# Altium schematic sheet Peripheral.SchDoc
size A4; SheetNumber: 5; SheetTotal: 5
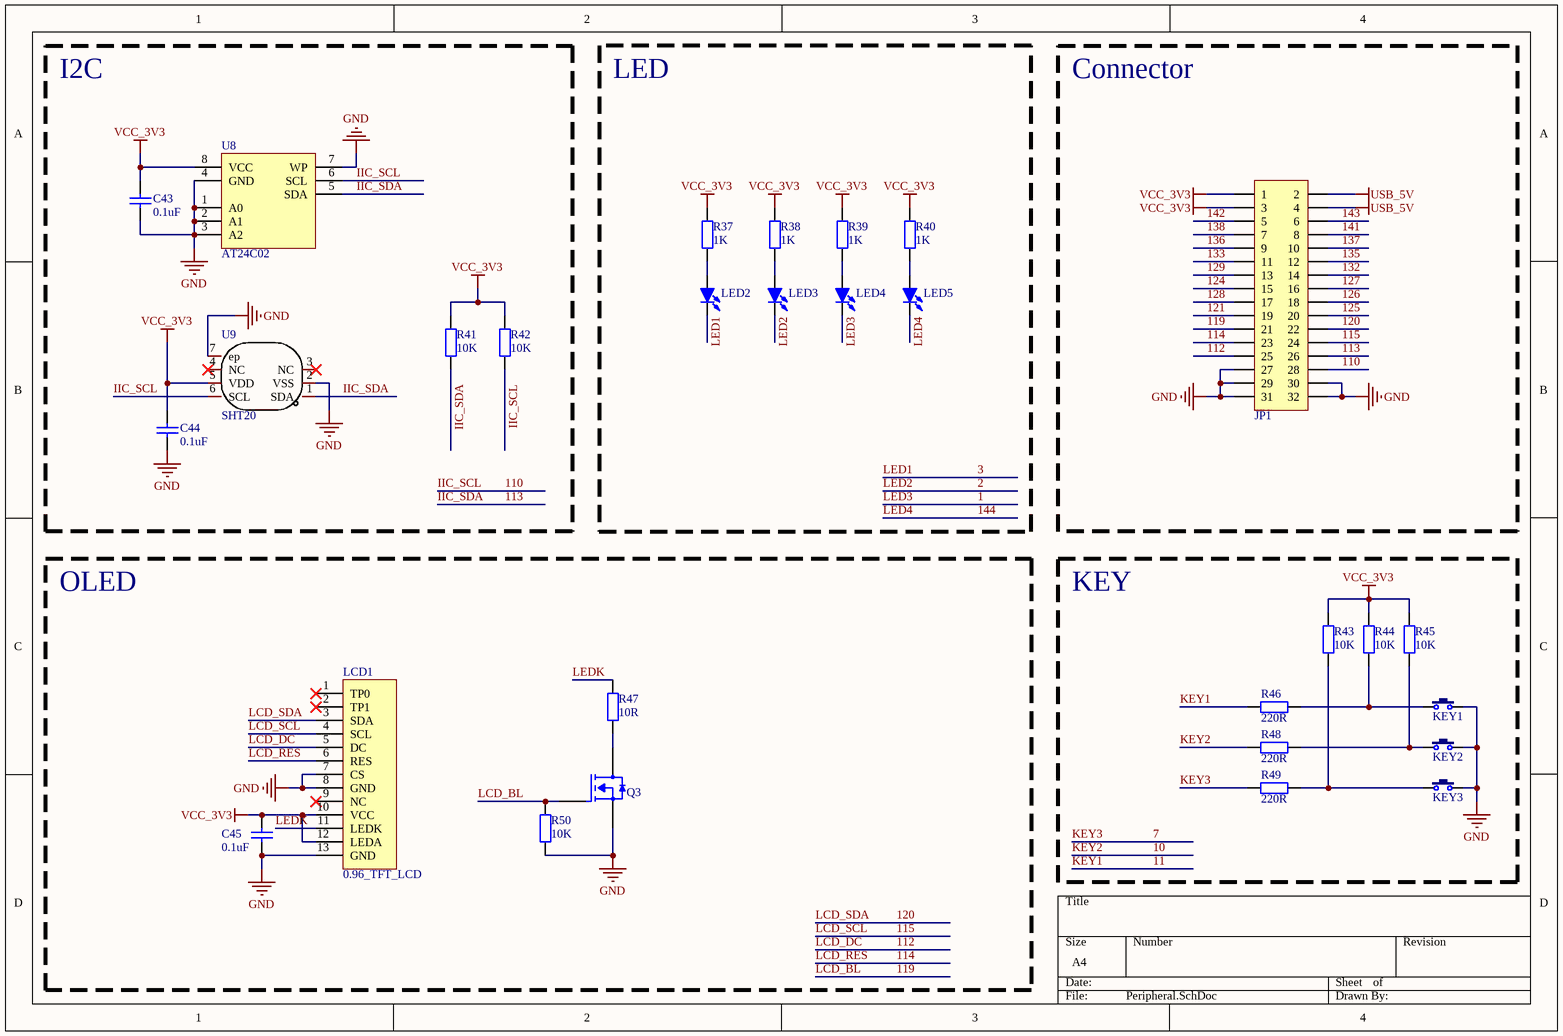
[diagram p0: Peripheral.SchDoc]

## Parts
C43  0.1uF  [0402_C]
C44  0.1uF  [0402_C]
C45  0.1uF  [0402_C]
JP1  Header 2X11  [HDR2.54-LI-2x16P]  (value not drawn)
KEY1  3x6x5  [SW]  (value not drawn)
KEY2  3x6x5  [SW]  (value not drawn)
KEY3  3x6x5  [SW]  (value not drawn)
LCD1  0.96_TFT_LCD  [0.78_TFT_LCD]
LED2  红色  [LED 0603B]  (value not drawn)
LED3  红色  [LED 0603G]  (value not drawn)
LED4  红色  [LED 0603R]  (value not drawn)
LED5  红色  [LED 0603R]  (value not drawn)
Q3  AO3400A  [SOT23-3]  (value not drawn)
R37  1K  [0402_R]
R38  1K  [0402_R]
R39  1K  [0402_R]
R40  1K  [0402_R]
R41  10K  [0402_R]
R42  10K  [0402_R]
R43  10K  [0402_R]
R44  10K  [0402_R]
R45  10K  [0402_R]
R46  220R  [0402_R]
R47  10R  [0402_R]
R48  220R  [0402_R]
R49  220R  [0402_R]
R50  10K  [0402_R]
U8  AT24C02  [SOP8_N]
U9  SHT20  [DFN-6_L3.0-W3.0-P0.95-TR-EP]

## Blocks framed on the sheet
I2C: C43 C44 R41 R42 U8 U9
LED: LED2-LED5 R37-R40
Connector: JP1
OLED: C45 LCD1 Q3 R47 R50
KEY: KEY1-KEY3 R43-R46 R48 R49

## Nets
GND: C43.1 C44.1 C45.1 JP1.27 JP1.29 JP1.30 JP1.31 JP1.32 KEY1.1 KEY2.1 KEY3.1 LCD1.7(CS) LCD1.8(GND) LCD1.13(GND) Q3.2(S) R50.1 U8.1(A0) U8.2(A1) U8.3(A2) U8.4(GND) U8.7(WP) U9.2(VSS) U9.7(ep)
USB_5V: JP1.2 JP1.4
VCC_3V3: C43.2 C44.2 C45.2 JP1.1 JP1.3 LCD1.10(VCC) LCD1.12(LEDA) R37.2 R38.2 R39.2 R40.2 R41.1 R42.1 R43.1 R44.2 R45.2 U8.8(VCC) U9.5(VDD)
1: LED4.2(K)  [also labelled LED3]
2: LED3.2(K)  [also labelled LED2]
3: LED2.2(K)  [also labelled LED1]
7: R49.2  [also labelled KEY3]
10: R48.2  [also labelled KEY2]
11: R46.2  [also labelled KEY1]
110: JP1.28 R42.2 U8.6(SCL) U9.6(SCL)  [also labelled IIC_SCL]
112: JP1.25 LCD1.5(DC)  [also labelled LCD_DC]
113: JP1.26 R41.2 U8.5(SDA) U9.1(SDA)  [also labelled IIC_SDA]
114: JP1.23 LCD1.6(RES)  [also labelled LCD_RES]
115: JP1.24 LCD1.4(SCL)  [also labelled LCD_SCL]
119: JP1.21 Q3.1(G) R50.2  [also labelled LCD_BL]
120: JP1.22 LCD1.3(SDA)  [also labelled LCD_SDA]
121: JP1.19
124: JP1.15
125: JP1.20
126: JP1.18
127: JP1.16
128: JP1.17
129: JP1.13
132: JP1.14
133: JP1.11
135: JP1.12
136: JP1.9
137: JP1.10
138: JP1.7
141: JP1.8
142: JP1.5
143: JP1.6
144: LED5.2(K)  [also labelled LED4]
LEDK: LCD1.11(LEDK) R47.2
NetKEY1_2: KEY1.2 R44.1 R46.1
NetKEY2_2: KEY2.2 R45.1 R48.1
NetKEY3_2: KEY3.2 R43.2 R49.1
NetLED2_1: LED2.1(A) R37.1
NetLED3_1: LED3.1(A) R38.1
NetLED4_1: LED4.1(A) R39.1
NetLED5_1: LED5.1(A) R40.1
NetQ3_3: Q3.3(D) R47.1

Not connected (* = marked no-connect by the designer): LCD1 1(TP0)* 2(TP1)* 9(NC)*; U9 3(NC)* 4(NC)*

## Library data of the parts
C43-C45 = 0402_C: 贴片电容; ComponentLink1Description: 供应商链接; ComponentLink1URL: http://www.szlcsc.com/product/details_1928.html; Package: 0402; Supplier: LC; SuppliersPartNumber: C1576
JP1 = Header 16X2_2.54: 16*2P接插件; 版权归属: 源创客; BOM名称: 16*2P接插件; 学习资源: www.ooocke.com
KEY1-KEY3 = TSW 3x6: 3x6轻触开关; 版权归属: 源创客; BOM名称: 3x6轻触开关; 学习资源: www.ooocke.com
LED2 = 0603_LED_B: 贴片LED; 版权归属: 源创客; BOM名称: 贴片LED; 学习资源: www.ooocke.com
LED3 = 0603_LED_G: 贴片LED; 版权归属: 源创客; BOM名称: 贴片LED; 学习资源: www.ooocke.com
LED4 LED5 = 0603_LED_R: 贴片LED; 版权归属: 源创客; BOM名称: 贴片LED; 学习资源: www.ooocke.com
Q3 = AO3400A: N-MOS
R37-R50 = 0402_R: 贴片电阻; ComponentLink1Description: 供应商链接; ComponentLink1URL: http://www.szlcsc.com/product/details_26667.html; Package: 0402; Supplier: LC; SuppliersPartNumber: C25924
U9 = SHT20: I2C接口，数字式温湿度传感器，电压范围: 2.1至3.6 V; Manufacturer: Sensirion(瑞士盛思锐); Add into BOM: yes; Symbol: SHT20; Device: SHT20; LCSC Part Name: SHT20; Supplier Part: C53865; Manufacturer Part: SHT20; Supplier Footprint: DFN-6-EP(3x3); JLCPCB Part Class: Extended Part; Datasheet: https://atta.szlcsc.com/upload/public/pdf/source/20151012/1457707445424.pdf; Supplier: LCSC; Convert to PCB: yes; Name: SHT20